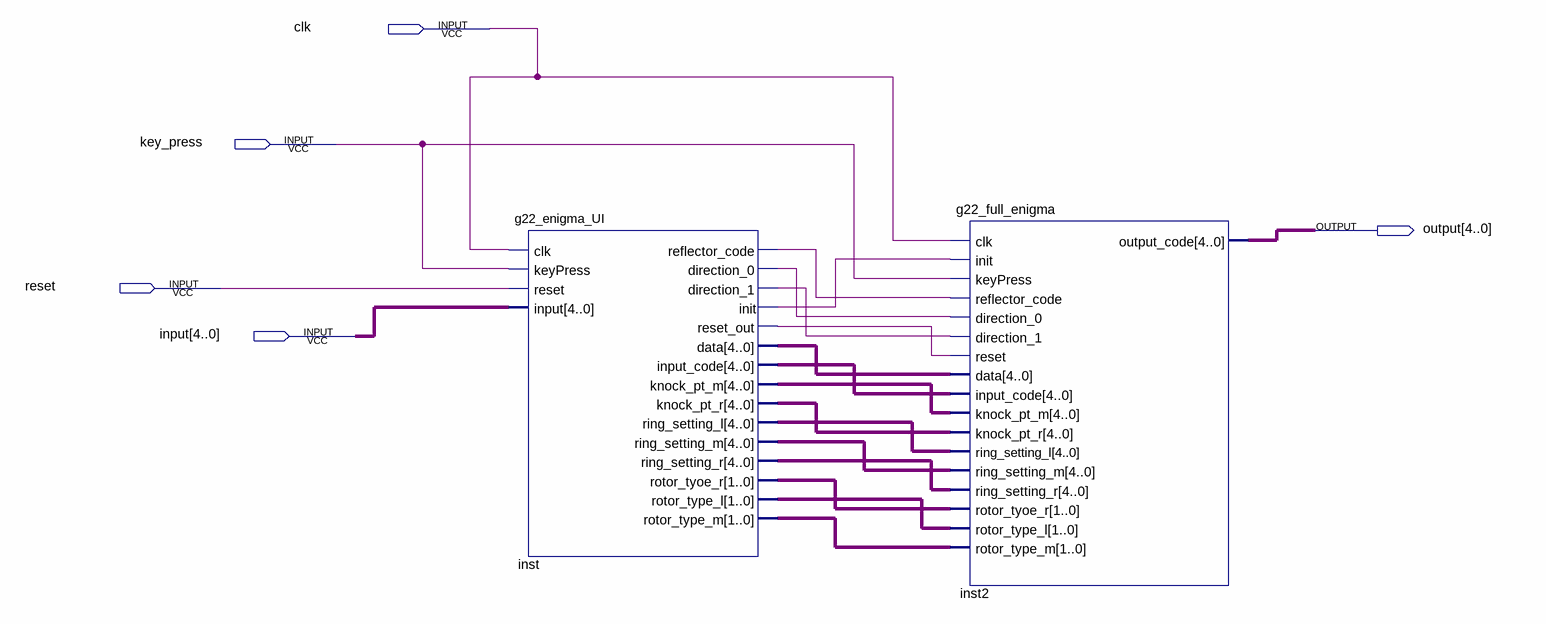
[diagram p0: schematic sheet]
// Quartus schematic g22_Enigma_Final.bdf as structural Verilog: 2 symbols, 5 pins
module g22_Enigma_Final (
  input  clk,
  input  key_press,
  input  reset,
  input  [4:0] \input ,
  output [4:0] \output 
);

  wire inst_direction_0, inst_direction_1, inst_init, inst_reflector_code, inst_reset_out;
  wire [1:0] inst_rotor_tyoe_r, inst_rotor_type_l, inst_rotor_type_m;
  wire [4:0] inst_data, inst_input_code, inst_knock_pt_m, inst_knock_pt_r, inst_ring_setting_l,
       inst_ring_setting_m, inst_ring_setting_r;

  g22_enigma_UI inst (
    .clk(clk), .keyPress(key_press), .reset(reset), .\input (\input ), .reflector_code(inst_reflector_code),
    .direction_0(inst_direction_0), .direction_1(inst_direction_1), .init(inst_init),
    .reset_out(inst_reset_out), .data(inst_data), .input_code(inst_input_code), .knock_pt_m(inst_knock_pt_m),
    .knock_pt_r(inst_knock_pt_r), .ring_setting_l(inst_ring_setting_l), .ring_setting_m(inst_ring_setting_m),
    .ring_setting_r(inst_ring_setting_r), .rotor_tyoe_r(inst_rotor_tyoe_r), .rotor_type_l(inst_rotor_type_l),
    .rotor_type_m(inst_rotor_type_m));
  g22_full_enigma inst2 (
    .clk(clk), .init(inst_init), .keyPress(key_press), .reflector_code(inst_reflector_code),
    .direction_0(inst_direction_0), .direction_1(inst_direction_1), .reset(inst_reset_out), .data(inst_data),
    .input_code(inst_input_code), .knock_pt_m(inst_knock_pt_m), .knock_pt_r(inst_knock_pt_r),
    .ring_setting_l(inst_ring_setting_l), .ring_setting_m(inst_ring_setting_m),
    .ring_setting_r(inst_ring_setting_r), .rotor_tyoe_r(inst_rotor_tyoe_r), .rotor_type_l(inst_rotor_type_l),
    .rotor_type_m(inst_rotor_type_m), .output_code(\output ));
endmodule
